# Altium project Servo-Board-v1.0.PrjPcb (part 19 of 19)

## Sheet DIO_4.SchDoc
size 420 x 297 mm; SheetNumber: 32; SheetTotal: 32
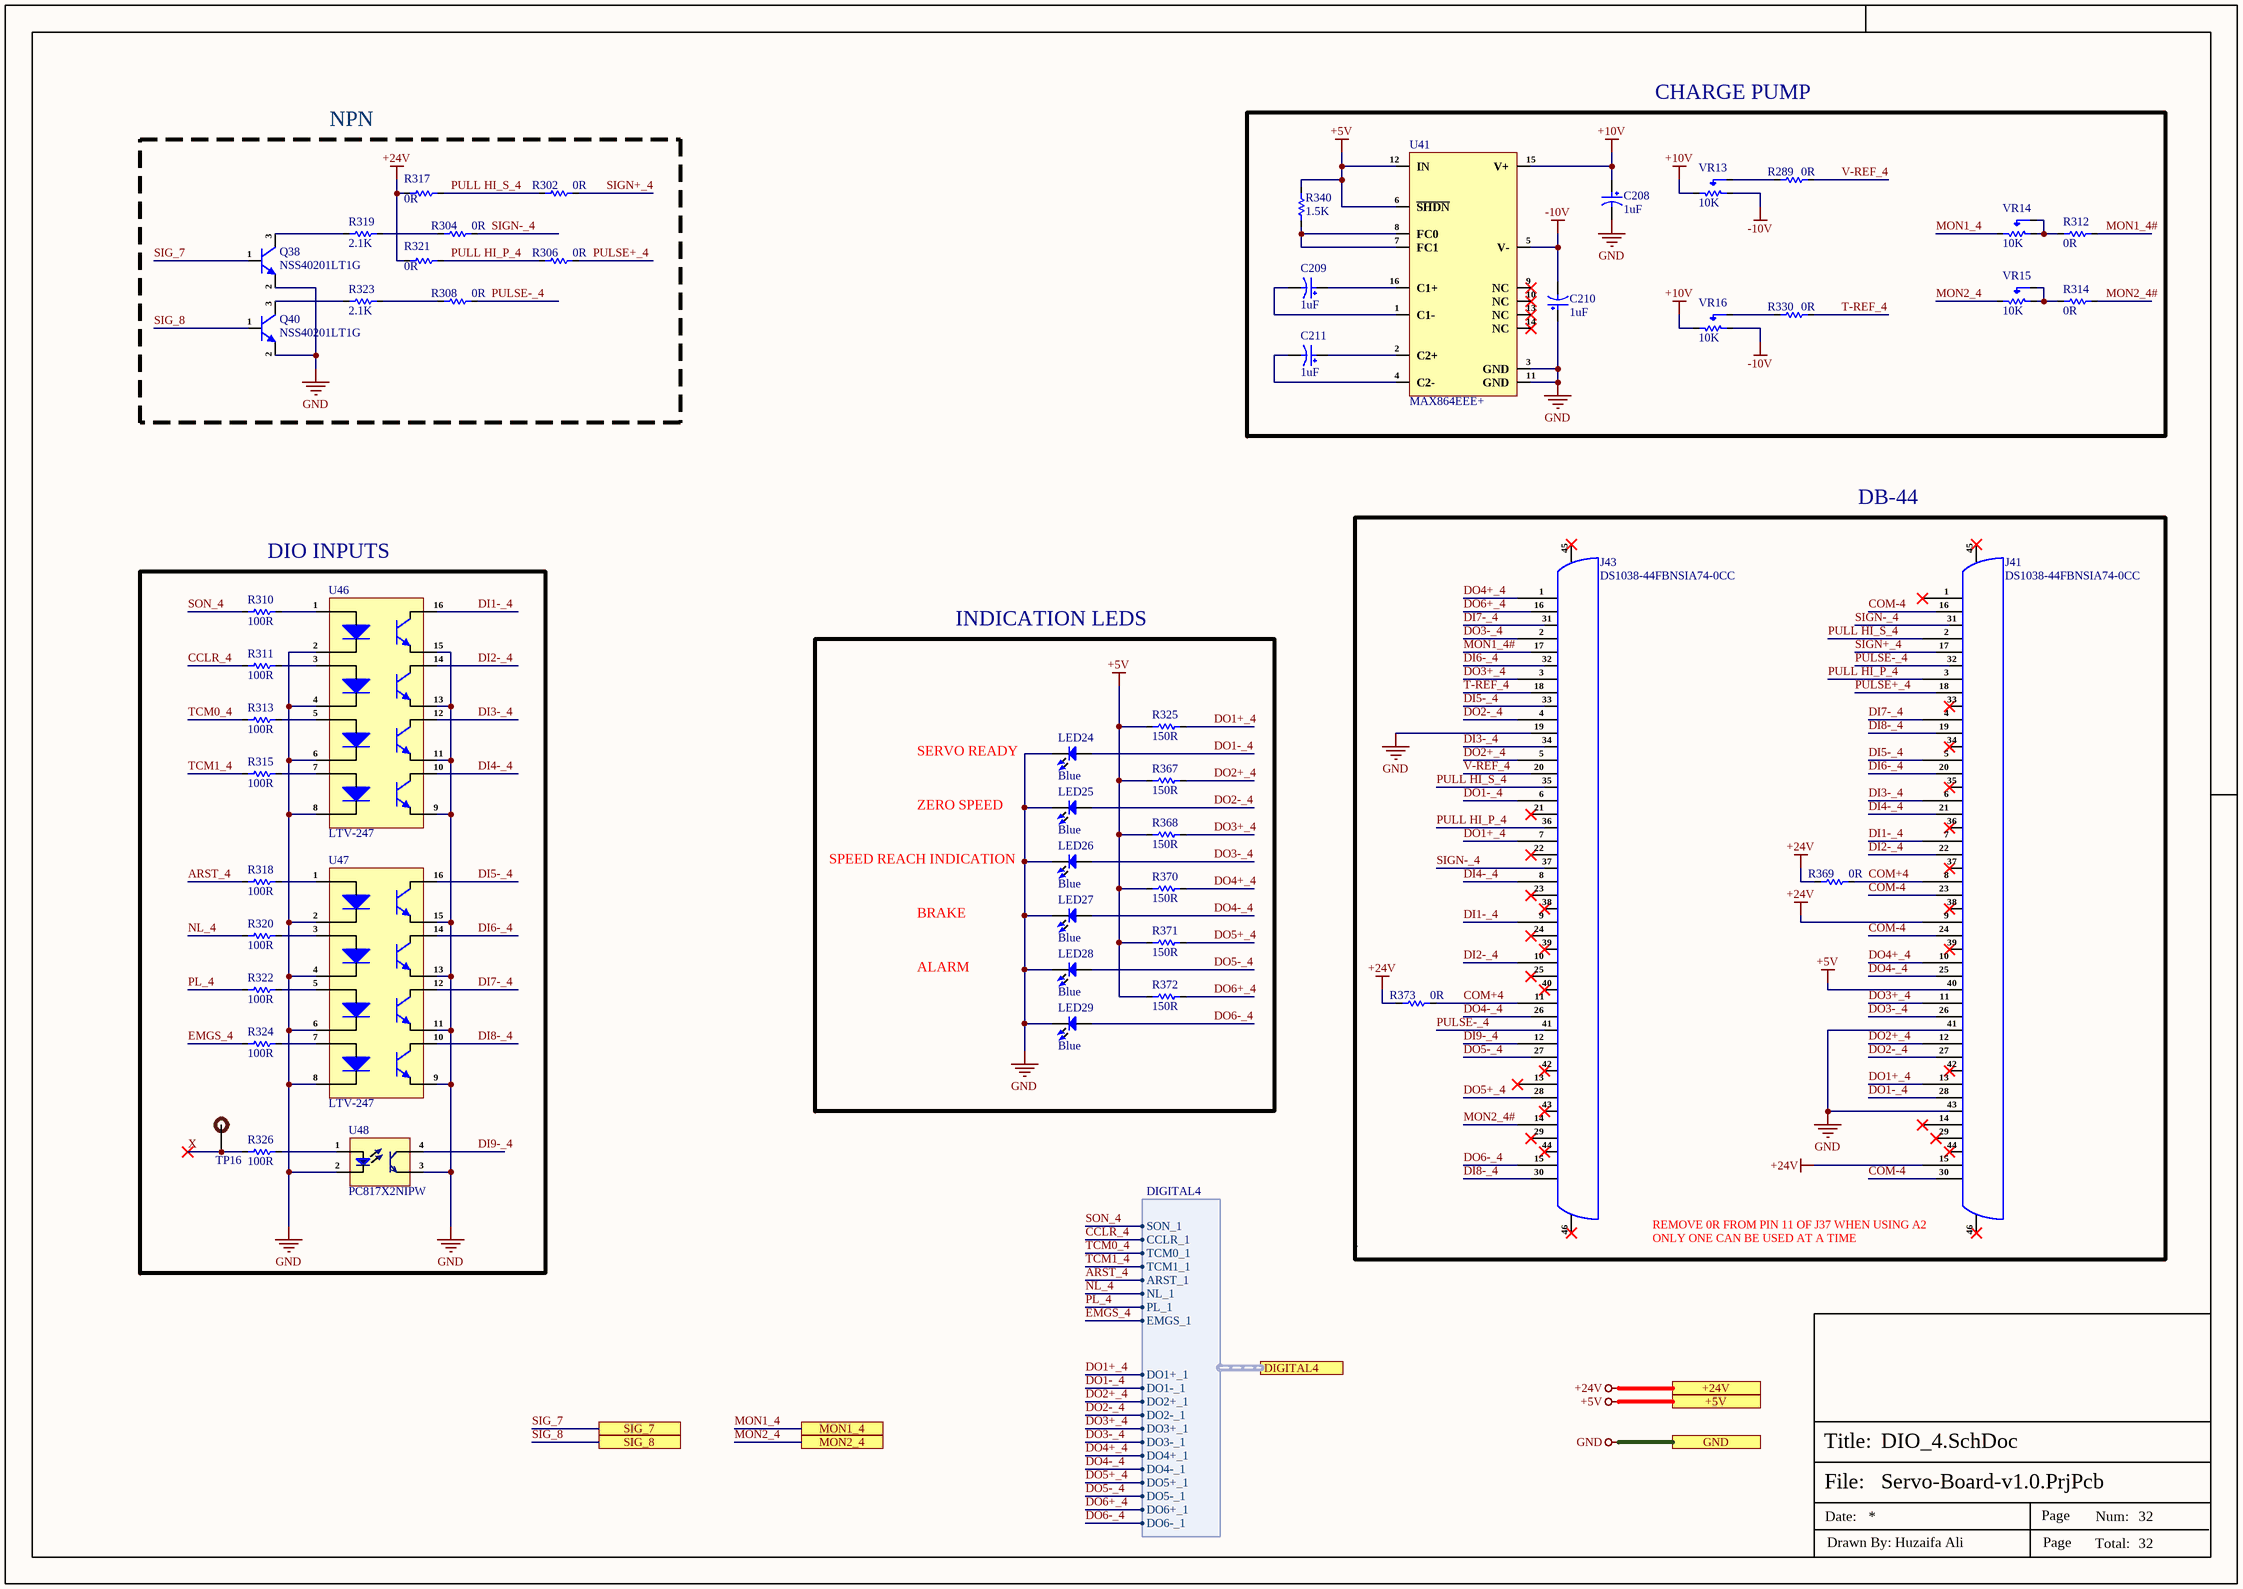
[diagram p31: DIO_4.SchDoc]

### Parts
C208  1uF  [RVT1H1R0M0405]
C209  1uF  [RVT1H1R0M0405]
C210  1uF  [RVT1H1R0M0405]
C211  1uF  [RVT1H1R0M0405]
J41  DS1038-44FBNSIA74-0CC  [DS1038-44FBNSIA74-0CC]
J43  DS1038-44FBNSIA74-0CC  [DS1038-44FBNSIA74-0CC]
LED24  Blue  [LED-0603]
LED25  Blue  [LED-0603]
LED26  Blue  [LED-0603]
LED27  Blue  [LED-0603]
LED28  Blue  [LED-0603]
LED29  Blue  [LED-0603]
Q38  NSS40201LT1G  [SOT-23]
Q40  NSS40201LT1G  [SOT-23]
R289  0R  [Res-0402]
R302  0R  [Res-0603]
R304  0R  [Res-0603]
R306  0R  [Res-0603]
R308  0R  [Res-0603]
R310  100R  [Res-0402]
R311  100R  [Res-0402]
R312  0R  [Res-0402]
R313  100R  [Res-0402]
R314  0R  [Res-0402]
R315  100R  [Res-0402]
R317  0R  [Res-0603]
R318  100R  [Res-0402]
R319  2.1K  [Res-0603]
R320  100R  [Res-0402]
R321  0R  [Res-0603]
R322  100R  [Res-0402]
R323  2.1K  [Res-0603]
R324  100R  [Res-0402]
R325  150R  [Res-0603]
R326  100R  [Res-0402]
R330  0R  [Res-0402]
R340  1.5K  [Res-0402]
R367  150R  [Res-0603]
R368  150R  [Res-0603]
R369  0R  [Res-0402]
R370  150R  [Res-0603]
R371  150R  [Res-0603]
R372  150R  [Res-0603]
R373  0R  [Res-0402]
TP16  TEST POINT  [Test-point]  (value not drawn)  (no BOM)
U41  MAX864EEE+  [16-QSOP]
U46  LTV-247  [16-SO]
U47  LTV-247  [16-SO]
U48  PC817X2NIPW  [PC817X2NIPW]
VR13  10K  [3362P-1-103]
VR14  10K  [3362P-1-103]
VR15  10K  [3362P-1-103]
VR16  10K  [3362P-1-103]

### Blocks framed on the sheet
NPN: Q38 Q40 R302 R304 R306 R308 R317 R319 R321 R323

### Ports
+5V (see Servo4[4C], CAN_Sheet[5D], DIO_1[5D], DIO_2[5D], DIO_3[5D], Encoder_Sheet1[5D], Encoder_Sheet2[5D], Encoder_Sheet3[5D], Encoder_Sheet4[5D], Power_Sheet[5D]), +24V (see Servo4[4C], Connector_Sheet[5D], DIO_1[5D], DIO_2[5D], DIO_3[5D], MOSFET_Driver_Sheet1[5D], MOSFET_Driver_Sheet2[5D], MOSFET_Driver_Sheet3[5D], MOSFET_Driver_Sheet4[5D], Motor_Driver_Sheet1[5D], Motor_Driver_Sheet2[5D], Motor_Driver_Sheet3[5D], Motor_Driver_Sheet4[5D], Power_Sheet[5D]), DIGITAL4 (harness DIGITAL4, see Servo4[4C], Sec_Controller_Sheet4[4D]), GND (see Servo4[4C], CAN_Sheet[5D], Connector_Sheet[5D], Controller_Sheet[5D], DIO_1[5D], DIO_2[5D], DIO_3[5D], Encoder_Sheet1[5D], Encoder_Sheet2[5D], Encoder_Sheet3[5D], Encoder_Sheet4[5D], EtherCAT_Sheet[5D], MOSFET_Driver_Sheet1[5D], MOSFET_Driver_Sheet2[5D], MOSFET_Driver_Sheet3[5D], MOSFET_Driver_Sheet4[5D], Motor_Driver_Sheet1[5D], Motor_Driver_Sheet2[5D], Motor_Driver_Sheet3[5D], Motor_Driver_Sheet4[5D], Power_Sheet[5D], RJ45_Sheet[5D], RS485_RS232_Sheet[3D], Sec_Controller_Sheet1[5D], Sec_Controller_Sheet2[5D], Sec_Controller_Sheet3[5D], Sec_Controller_Sheet4[5D]), MON1_4 (see Servo4[4C], Sec_Controller_Sheet4[3D]), MON2_4 (see Servo4[4C], Sec_Controller_Sheet4[3D]), SIG_7 (see Servo4[4C], Sec_Controller_Sheet4[3D]), SIG_8 (see Servo4[4C], Sec_Controller_Sheet4[3D])

### Harnesses
DIGITAL4: SON_1, TCM0_1, CCLR_1, TCM1_1, ARST_1, NL_1, PL_1, EMGS_1, DO1+_1, DO1-_1, DO2+_1, DO2-_1, DO3+_1, DO3-_1, DO4+_1, DO4-_1, DO5+_1, DO5-_1, DO6+_1, DO6-_1

### Nets
+5V: J41.40 R325.1 R340.2 R367.1 R368.1 R370.1 R371.1 R372.1 U41.6(~{SHDN}) U41.12(IN) ; port +5V
+10V: C208.1 U41.15(V+) VR13.3(CW) VR16.3(CW)
+24V: J41.9 J41.15 R317.1 R321.1 R369.1 R373.1 ; port +24V  [project net VDRAIN]
-10V: C210.2 U41.5(V-) VR13.1(CCW) VR16.1(CCW)
GND: C208.2 C210.1 J41.41 J41.43 J43.19 LED24.2 LED25.2 LED26.2 LED27.2 LED28.2 LED29.2 Q38.2(E) Q40.2(E) U41.3(GND) U41.11(GND) U46.2(K) U46.4(K) U46.6(K) U46.8(K) U46.9(E) U46.11(E) U46.13(E) U46.15(E) U47.2(K) U47.4(K) U47.6(K) U47.8(K) U47.9(E) U47.11(E) U47.13(E) U47.15(E) U48.2(Ca) U48.3(E) ; port GND
ARST_4: R318.1 ; port DIGITAL4.ARST_1
CCLR_4: R311.1 ; port DIGITAL4.CCLR_1
COM+4: J41.8 J43.11 R369.2 R373.2
COM-4: J41.16 J41.23 J41.24 J41.30
DI1-_4: J41.7 J43.9 U46.16(C)
DI2-_4: J41.22 J43.10 U46.14(C)
DI3-_4: J41.6 J43.34 U46.12(C)
DI4-_4: J41.21 J43.8 U46.10(C)
DI5-_4: J41.5 J43.33 U47.16(C)
DI6-_4: J41.20 J43.32 U47.14(C)
DI7-_4: J41.4 J43.31 U47.12(C)
DI8-_4: J41.19 J43.30 U47.10(C)
DI9-_4: J43.12 U48.4(C)
DO1+_4: J41.13 J43.7 R325.2 ; port DIGITAL4.DO1+_1
DO1-_4: J41.28 J43.6 LED24.1 ; port DIGITAL4.DO1-_1
DO2+_4: J41.12 J43.5 R367.2 ; port DIGITAL4.DO2+_1
DO2-_4: J41.27 J43.4 LED25.1 ; port DIGITAL4.DO2-_1
DO3+_4: J41.11 J43.3 R368.2 ; port DIGITAL4.DO3+_1
DO3-_4: J41.26 J43.2 LED26.1 ; port DIGITAL4.DO3-_1
DO4+_4: J41.10 J43.1 R370.2 ; port DIGITAL4.DO4+_1
DO4-_4: J41.25 J43.26 LED27.1 ; port DIGITAL4.DO4-_1
DO5+_4: J43.28 R371.2 ; port DIGITAL4.DO5+_1
DO5-_4: J43.27 LED28.1 ; port DIGITAL4.DO5-_1
DO6+_4: J43.16 R372.2 ; port DIGITAL4.DO6+_1
DO6-_4: J43.15 LED29.1 ; port DIGITAL4.DO6-_1
EMGS_4: R324.1 ; port DIGITAL4.EMGS_1
MON1_4: VR14.3(CW) ; port MON1_4
MON1_4#: J43.17 R312.2
MON2_4: VR15.3(CW) ; port MON2_4
MON2_4#: J43.14 R314.2
NL_4: R320.1 ; port DIGITAL4.NL_1
PL_4: R322.1 ; port DIGITAL4.PL_1
PULL HI_P_4: J41.3 J43.36 R306.1 R321.2
PULL HI_S_4: J41.2 J43.35 R302.1 R317.2
PULSE+_4: J41.18 R306.2
PULSE-_4: J41.32 J43.41 R308.2
SIG_7: Q38.1(B) ; port SIG_7
SIG_8: Q40.1(B) ; port SIG_8
SIGN+_4: J41.17 R302.2
SIGN-_4: J41.31 J43.37 R304.2
SON_4: R310.1 ; port DIGITAL4.SON_1
T-REF_4: J43.18 R330.2
TCM0_4: R313.1 ; port DIGITAL4.TCM0_1
TCM1_4: R315.1 ; port DIGITAL4.TCM1_1
V-REF_4: J43.20 R289.2
X: R326.1 TP16.1
NetC209_1: C209.1 U41.16(C1+)
NetC209_2: C209.2 U41.1(C1-)
NetC211_1: C211.1 U41.2(C2+)
NetC211_2: C211.2 U41.4(C2-)
NetQ38_3: Q38.3(C) R319.1
NetQ40_3: Q40.3(C) R323.1
NetR289_1: R289.1 VR13.2(Wiper)
NetR304_1: R304.1 R319.2
NetR308_1: R308.1 R323.2
NetR310_2: R310.2 U46.1(A)
NetR311_2: R311.2 U46.3(A)
NetR312_1: R312.1 VR14.1(CCW) VR14.2(Wiper)
NetR313_2: R313.2 U46.5(A)
NetR314_1: R314.1 VR15.1(CCW) VR15.2(Wiper)
NetR315_2: R315.2 U46.7(A)
NetR318_2: R318.2 U47.1(A)
NetR320_2: R320.2 U47.3(A)
NetR322_2: R322.2 U47.5(A)
NetR324_2: R324.2 U47.7(A)
NetR326_2: R326.2 U48.1(An)
NetR330_1: R330.1 VR16.2(Wiper)
NetR340_1: R340.1 U41.7(FC1) U41.8(FC0)

Not connected (* = marked no-connect by the designer): J41 1* 14* 29* 33* 34* 35* 36* 37* 38* 39* 42* 44* 45* 46*; J43 13* 21* 22* 23* 24* 25* 29* 38* 39* 40* 42* 43* 44* 45* 46*; U41 9(NC)* 10(NC)* 13(NC)* 14(NC)*

### Notes on the sheet
- CHARGE PUMP
- DB-44
- DIO INPUTS
- INDICATION LEDS
- SERVO READY
- SPEED REACH INDICATION
- ZERO SPEED
- BRAKE
- ALARM
- REMOVE 0R FROM PIN 11 OF J37 WHEN USING A2
- ONLY ONE CAN BE USED AT A TIME
- File:
- Title:
- Date:
- Page
- Num:
- Total:
- Drawn By: Huzaifa Ali

### Library data of the parts
C208-C211 = RVT1H1R0M0405: 1uF 50V 8mA@120Hz ±20% SMD,D4xL5.4mm Aluminum Electrolytic Capacitors - SMD ROHS; Manufacturer: Roqang; Supplier: LCSC; LCSC Part Number: C72491; Manufacturer Part Number: RVT1H1R0M0405; RoHS: No
J41 J43 = DS1038-44FBNSIA74-0CC: 44P Female D-Sub Right-Angle 3 1.5A -40℃~+105℃ Push-Pull D-Sub / VGA connector ROHS; Manufacturer: CONNFLY Elec; Manufacturer Part Number: DS1038-44FBNSIA74-0CC; Package: Push-Pull; LCSC Part Number: C77844; Item Type: D-Sub / VGA connector; ComponentLink1Description: LCSC; ComponentLink1URL: https://www.lcsc.com/product-detail/D-Sub-VGA-connector_CONNFLY-Elec-DS1038-44FBNSIA74-0CC_C77844.html
LED24-LED29 = NCD0603B3: blue 0603 Light Emitting Diodes (LED) ROHS; Manufacturer: Foshan NationStar Optoelectronics; Manufacturer Part Number: NCD0603B3; Package: 0603; LCSC Part Number: C158101; Item Type: LED; ComponentLink1Description: LCSC; ComponentLink1URL: https://www.lcsc.com/product-detail/Light-Emitting-Diodes-LED_Foshan-NationStar-Optoelectronics-NCD0603B3_C158101.html
Q38 Q40 = NSS40201LT1G: TRANS NPN 40V 2A SOT23-3; Manufacturer: ON Semiconductor; Max Power Dissipation: 540mW; Transition Frequency: 150MHz; hFE Min: 200; Number of Elements: 1; Emitter Base Voltage (VEBO): 6V; Collector Emitter Saturation Voltage: 115mV; Element Configuration: Single; Clock Frequency: 100MHz; Item Type: Transistor; Supplier 1: Future Electronics; Manufacturer Part Number: NSS40201LT1G; RoHS: Yes; Category: BJTs; Stock 1: 155; Pricing 1: 1=0.42000, 15=0.34000, 75=0.29500, 300=0.25500, 1500=0.21000 (USD); Case/Package: SOT-23-3; Pins: 3; Min Operating Temperature: -55°C; Max Operating Temperature: 150°C; Collector Emitter Voltage (VCEO): 40V; Packaging: Tape and Reel; Max Collector Current: 2A; Collector Emitter Breakdown Voltage: 40V; Polarity: NPN; Package Quantity: 3000; Frequency: 150MHz; Max Breakdown Voltage: 40V; Collector Base Voltage (VCBO): 40V; Power Dissipation: 540mW; Gain Bandwidth Product: 150MHz; Series: -; Collector-emitter Voltage-Max: 115mV; Length: 3.04mm; Width: 2.64mm; Height: 1.11mm; Radiation Hardening: No; Lead Free: Lead Free; Reach SVHC Compliant: Yes; Halogen Free: Halogen Free; RoHS Compliant: Yes; ComponentLink1URL: https://datasheet.ciiva.com/976/nss40201l-d-976800.pdf?src-supplier=Digi-Key; ComponentLink1Description: https://datasheet.ciiva.com/976/nss40201l-d-976800.pdf?src-supplier=Digi-Key; ComponentLink2URL: https://datasheet.ciiva.com/11204/nss40201l-d-11204882.pdf?src-supplier=Avnet; ComponentLink2Description: https://datasheet.ciiva.com/11204/nss40201l-d-11204882.pdf?src-supplier=Avnet; ComponentLink3URL: https://datasheet.ciiva.com/16291/nss40201l-d-115376-16291797.pdf?src-supplier=Mouser; ComponentLink3Description: https://datasheet.ciiva.com/16291/nss40201l-d-115376-16291797.pdf?src-supplier=Mouser; ComponentLink4URL: https://datasheet.ciiva.com/30480/0900766b8121b5a5-30480502.pdf?src-supplier=Rs; ComponentLink4Description: https://datasheet.ciiva.com/30480/0900766b8121b5a5-30480502.pdf?src-supplier=Rs; ComponentLink5URL: https://datasheet.ciiva.com/976/nss40201l-d-976801.pdf?src-supplier=Digi-Key; ComponentLink5Description: https://datasheet.ciiva.com/976/nss40201l-d-976801.pdf?src-supplier=Digi-Key; ComponentLink6URL: https://datasheet.ciiva.com/976/nss40201l-d-976802.pdf?src-supplier=Digi-Key; ComponentLink6Description: https://datasheet.ciiva.com/976/nss40201l-d-976802.pdf?src-supplier=Digi-Key; ComponentLink7URL: https://datasheet.ciiva.com/22641/nss40201l-d-22641179.pdf?src-supplier=Farnell; ComponentLink7Description: https://datasheet.ciiva.com/22641/nss40201l-d-22641179.pdf?src-supplier=Farnell; ComponentLink8URL: https://datasheet.ciiva.com/16222/nss40201l-d-16222093.pdf?src-supplier=Future+Electronics; ComponentLink8Description: https://datasheet.ciiva.com/16222/nss40201l-d-16222093.pdf?src-supplier=Future+Electronics; Supplier Part Number 1: 6030674; LCSC Part Number: C145175
R289 R312 R314 R330 R369 R373 = RC0402FR-070RL: RES 0 OHM JUMPER 1/16W 0402; Manufacturer: Yageo; Item Type: Resistors; Tolerance: 1%; Power Rating: 62.5mW; Voltage Rating: 50V; Temperature Coefficient: 200ppm/°C; Max Power Dissipation: 63mW; Supplier 1: Mouser; Manufacturer Part Number: RC0402FR-070RL; RoHS: Yes; Stock 1: 8556842; Pricing 1: 1=0.10000, 10=0.01400, 50=0.01400, 100=0.00600, 1000=0.00300, 5000=0.00200, 10000=0.00100 (USD); Mount: Surface Mount; Case/Package: 0402; Contact Plating: Tin,Matte; Case Code (Imperial): 0402; Case Code (Metric): 1005; Size Code: 0402; Min Operating Temperature: -55°C; Max Operating Temperature: 155°C; Resistance: 0R; Resistor Type: Thick Film; Packaging: Tape and Reel; Termination: SMD/SMT; Features: Moisture Resistant; Series: RC; Number of Terminations: 2; Length: 1mm; Width: 0.5mm; Height: 0.35mm; Radiation Hardening: No; Lead Free: Lead Free; RoHS Compliant: Yes; ComponentLink1URL: https://datasheet.ciiva.com/8896/pyu-rc0402-51-rohs-l-6-8896149.pdf?src-supplier=Avnet; ComponentLink1Description: https://datasheet.ciiva.com/8896/pyu-rc0402-51-rohs-l-6-8896149.pdf?src-supplier=Avnet; ComponentLink2URL: https://datasheet.ciiva.com/16790/pyu-rc0402-51-rohs-l-6-r-16790444.pdf?src-supplier=Future+Electronics; ComponentLink2Description: https://datasheet.ciiva.com/16790/pyu-rc0402-51-rohs-l-6-r-16790444.pdf?src-supplier=Future+Electronics; Supplier Part Number 1: 603-RC0402FR-070RL; LCSC Part Number: C106231
R302 R304 R306 R308 R317 R321 = RC0603JR-070RL: RES 0 OHM JUMPER 1/10W 0603; Manufacturer: Yageo; Resistance: 0mR; Tolerance: 1%; Power Rating: 100mW; Voltage Rating (DC): 50V; Temperature Coefficient: 200ppm/°C; Resistance Tolerance: 5%; Item Type: Resistor; Supplier 1: Digi-Key; Manufacturer Part Number: RC0603JR-070RL; RoHS: Yes; Category: Chip SMD Resistors; Stock 1: 18081776; Pricing 1: 1=0.10000, 10=0.01700, 25=0.01240, 50=0.00960, 100=0.00700, 250=0.00536, 500=0.00430, 1000=0.00316 (USD); Case/Package: 0603; Number of Pins: 2; Contact Plating: Tin,Matte; Case Code (Imperial): 0603; Case Code (Metric): 1608; Size Code: 0603; Min Operating Temperature: -55°C; Max Operating Temperature: 155°C; Resistor Type: Thick Film; Packaging: Tape and Reel; Termination: SMD/SMT; Series: RC; Technology: THICK FILM; Package Quantity: 5000; Voltage Rating: 50V; Features: Moisture Resistant; Max Power Dissipation: 100mW; Number of Terminations: 2; Construction: Rectangular; Length: 1.6mm; Width: 0.8mm; Height: 0.45mm; Depth: 0.8mm; Radiation Hardening: No; Reach SVHC Compliant: No SVHC; Lead Free: Lead Free; RoHS Compliant: Yes; Military Standard: Not; Supplier Part Number 1: 311-0.0GRCT-ND; LCSC Part Number: C95177
R310 R311 R313 R315 R318 R320 R322 R324 R326 = RC0402FR-07100RL: RES 100 OHM 1% 1/16W 0402; Manufacturer: Yageo; Power Rating: 62.5mW; Voltage Rating: 50V; Temperature Coefficient: 100ppm/°C; Max Power Dissipation: 63mW; Item Type: Resistor; Supplier 1: Mouser; Manufacturer Part Number: RC0402FR-07100RL; RoHS: Yes; Category: Chip SMD Resistors; Stock 1: 699545; Pricing 1: 1=0.10000, 10=0.01200, 50=0.01200, 100=0.00500, 1000=0.00300, 2500=0.00200, 10000=0.00100 (USD); Case/Package: 0402; Number of Pins: 2; Case Code (Imperial): 0402; Case Code (Metric): 1005; Size Code: 0402; Min Operating Temperature: -55°C; Max Operating Temperature: 155°C; Tolerance: 1%; Voltage Rating (DC): 50V; Resistance: 100R; Packaging: Tape and Reel; Termination: SMD/SMT; Resistor Type: Thick Film; Features: Moisture Resistant; Series: RC; Number of Terminations: 2; Resistance Tolerance: 1%; Construction: Rectangular; Technology: THICK FILM; Length: 1mm; Width: 0.5mm; Height: 0.32mm; Depth: 0.5mm; RoHS Compliant: Yes; REACH SVHC: No SVHC; Military Standard: Not; Lead Free: Lead Free; ComponentLink1URL: https://datasheet.ciiva.com/11808/0900766b80c66297-11808765.pdf?src-supplier=RSComponents; ComponentLink1Description: https://datasheet.ciiva.com/11808/0900766b80c66297-11808765.pdf?src-supplier=RSComponents; ComponentLink2URL: https://datasheet.ciiva.com/7849/1784430-7849810.pdf?src-supplier=Element14; ComponentLink2Description: https://datasheet.ciiva.com/7849/1784430-7849810.pdf?src-supplier=Element14; ComponentLink3URL: https://datasheet.ciiva.com/28367/1018594-28367226.pdf?src-supplier=Element14; ComponentLink3Description: https://datasheet.ciiva.com/28367/1018594-28367226.pdf?src-supplier=Element14; ComponentLink4URL: https://datasheet.ciiva.com/22747/1018594-22747511.pdf?src-supplier=Element14; ComponentLink4Description: https://datasheet.ciiva.com/22747/1018594-22747511.pdf?src-supplier=Element14; ComponentLink5URL: https://datasheet.ciiva.com/12667/pyu-rc0402-51-rohs-l-6-r-12667957.pdf?src-supplier=Mouser; ComponentLink5Description: https://datasheet.ciiva.com/12667/pyu-rc0402-51-rohs-l-6-r-12667957.pdf?src-supplier=Mouser; ComponentLink6URL: https://datasheet.ciiva.com/15189/getdatasheetpartid-329466-15189335.pdf?src-supplier=Verical; ComponentLink6Description: https://datasheet.ciiva.com/15189/getdatasheetpartid-329466-15189335.pdf?src-supplier=Verical; ComponentLink7URL: https://datasheet.ciiva.com/16740/pyu-rc0402-51-rohs-l-6-r-16740566.pdf?src-supplier=Future+Electronics; ComponentLink7Description: https://datasheet.ciiva.com/16740/pyu-rc0402-51-rohs-l-6-r-16740566.pdf?src-supplier=Future+Electronics; Supplier Part Number 1: 603-RC0402FR-07100RL; LCSC Part Number: C106232
R319 R323 = RT0603BRD072K1L: RES SMD 2.1K OHM 0.1% 1/10W 0603; Manufacturer: Yageo; Resistance: 2.1kR; Voltage Rating: 75V; Power Rating: 100mW; Temperature Coefficient: 25ppm/°C; Voltage Rating (DC): 50V; Item Type: Resistor; Supplier 1: Arrow Electronics; Manufacturer Part Number: RT0603BRD072K1L; RoHS: Yes; Category: Chip SMD Resistors; Stock 1: 4891; Pricing 1: 1=0.32000, 10=0.26320, 25=0.26040, 100=0.10310, 250=0.10280, 500=0.10180, 1000=0.06110, 3000=0.03900 (USD); Case/Package: 0603; Case Code (Imperial): 0603; Case Code (Metric): 1608; Min Operating Temperature: -55°C; Max Operating Temperature: 125°C; Tolerance: 0.1%; Packaging: Tape and Reel; Resistor Type: Thin Film; Number of Terminations: 2; Termination: SMD/SMT; Max Power Dissipation: 100mW; Features: Moisture Resistant; Series: RT; Construction: Rectangular; Length: 0.063inch; Width: 0.031inch; Height: 0.022inch; Depth: 0.8mm; Military Standard: Not; Lead Free: Lead Free; RoHS Compliant: Yes; ComponentLink1URL: https://datasheet.ciiva.com/12723/pyu-rt-1-to-0-05-rohs-l-4-12723880.pdf?src-supplier=Mouser; ComponentLink1Description: https://datasheet.ciiva.com/12723/pyu-rt-1-to-0-05-rohs-l-4-12723880.pdf?src-supplier=Mouser; Supplier Part Number 1: RT0603BRD072K1L; LCSC Part Number: C861293
R325 R367 R368 R370-R372 = RC0603DR-07150RL: RES 150 OHM 0.5% 1/10W 0603; Manufacturer: Yageo; Max Power Dissipation: 100mW; Temperature Coefficient: 100ppm/°C; Item Type: Resistor; Supplier 1: Avnet; Manufacturer Part Number: RC0603DR-07150RL; RoHS: Yes; Category: Chip SMD Resistors; Pricing 1: 5000=0.00430, 10000=0.00424, 20000=0.00411 (USD); Case/Package: 0603; Min Operating Temperature: -55°C; Max Operating Temperature: 155°C; Packaging: Tape and Reel; Resistance: 150R; Resistor Type: Thick Film; Number of Terminations: 2; Tolerance: 0.5%; Features: Moisture Resistant; Length: 0.063inch; Width: 0.031inch; Height: 0.022inch; RoHS Compliant: Yes; ComponentLink1URL: http://www.yageo.com.tw/exep/pages/download/literatures/PYu-R_INT-thick_7.pdf?src-supplier=Digi-Key; ComponentLink1Description: http://www.yageo.com.tw/exep/pages/download/literatures/PYu-R_INT-thick_7.pdf?src-supplier=Digi-Key; Supplier Part Number 1: RC0603DR-07150RL; LCSC Part Number: C471801
R340 = RC0402FR-071K5L: RES 1.5K OHM 1% 1/16W 0402; Manufacturer: Yageo; Resistance: 1.5kR; Power Rating: 62.5mW; Voltage Rating: 50V; Temperature Coefficient: 100ppm/°C; Max Power Dissipation: 63mW; Supplier 1: Digi-Key; Manufacturer Part Number: RC0402FR-071K5L; RoHS: Yes; Category: Chip SMD Resistors; Stock 1: 2832947; Pricing 1: 1=0.10000, 10=0.01500, 100=0.00610, 1000=0.00275, 2500=0.00239, 5000=0.00197 (USD); Case/Package: 0402; Case Code (Metric): 1005; Case Code (Imperial): 0402; Size Code: 0402; Min Operating Temperature: -55°C; Max Operating Temperature: 155°C; Resistor Type: Thick Film; Package Quantity: 1; Tolerance: 1%; Packaging: Tape and Reel; Number of Terminations: 2; Termination: SMD/SMT; Features: Moisture Resistant; Series: RC; Resistance Tolerance: 1%; Construction: Rectangular; Technology: THICK FILM; Length: 1mm; Width: 0.02inch; Height: 0.016inch; Depth: 0.5mm; RoHS Compliant: Yes; REACH SVHC: No SVHC; Military Standard: Not; Lead Free: Lead Free; ComponentLink1URL: https://datasheet.ciiva.com/11808/0900766b80c66297-11808238.pdf?src-supplier=RSComponents; ComponentLink1Description: https://datasheet.ciiva.com/11808/0900766b80c66297-11808238.pdf?src-supplier=RSComponents; ComponentLink2URL: https://datasheet.ciiva.com/46394/1018594-46394950.pdf?src-supplier=Element14; ComponentLink2Description: https://datasheet.ciiva.com/46394/1018594-46394950.pdf?src-supplier=Element14; ComponentLink3URL: https://datasheet.ciiva.com/2453/pyu-r-int-thick-7-2453440.pdf?src-supplier=Digi-Key; ComponentLink3Description: https://datasheet.ciiva.com/2453/pyu-r-int-thick-7-2453440.pdf?src-supplier=Digi-Key; ComponentLink4URL: https://datasheet.ciiva.com/2453/pyu-r-int-thick-7-2453441.pdf?src-supplier=Digi-Key; ComponentLink4Description: https://datasheet.ciiva.com/2453/pyu-r-int-thick-7-2453441.pdf?src-supplier=Digi-Key; ComponentLink5URL: https://datasheet.ciiva.com/2453/pyu-r-int-thick-7-2453439.pdf?src-supplier=Digi-Key; ComponentLink5Description: https://datasheet.ciiva.com/2453/pyu-r-int-thick-7-2453439.pdf?src-supplier=Digi-Key; ComponentLink6URL: https://datasheet.ciiva.com/12558/pyu-rc0402-51-rohs-l-6-r-8721-12558542.pdf?src-supplier=Mouser; ComponentLink6Description: https://datasheet.ciiva.com/12558/pyu-rc0402-51-rohs-l-6-r-8721-12558542.pdf?src-supplier=Mouser; ComponentLink7URL: https://datasheet.ciiva.com/7849/1018594-7849863.pdf?src-supplier=Element14; ComponentLink7Description: https://datasheet.ciiva.com/7849/1018594-7849863.pdf?src-supplier=Element14; ComponentLink8URL: https://datasheet.ciiva.com/7849/1018594-7849864.pdf?src-supplier=Element14; ComponentLink8Description: https://datasheet.ciiva.com/7849/1018594-7849864.pdf?src-supplier=Element14; ComponentLink9URL: https://datasheet.ciiva.com/15189/getdatasheetpartid-323992-15189370.pdf?src-supplier=Verical; ComponentLink9Description: https://datasheet.ciiva.com/15189/getdatasheetpartid-323992-15189370.pdf?src-supplier=Verical; Supplier Part Number 1: 311-1.50KLRCT-ND; LCSC Part Number: C114759
TP16 = TEST POINT: Test Point ON; Item Type: TEST POINT
U41 = MAX864EEE+: IC REG CHARGE PUMP INV 16QSOP; Manufacturer: Maxim; Output Current: 20mA; Output Voltage: 12V; Logic Function: Inverting; Number of Outputs: 2; Switching Frequency: 185kHz; Synchronous Rectifier: No; Topology: Boost; Output Type: Adjustable; Max Supply Voltage: 6V; Min Supply Voltage: 1.75V; Operating Supply Current: 7mA; Min Output Voltage: 3.5V; Supplier: Digikey; Supplier Part Number: MAX864EEE+-ND; Manufacturer Part Number: MAX864EEE+; RoHS: Yes; Item Type: IC; Stock: 443; Pricing: 1=4.9, 10=4.399, 25=4.1588, 100=3.6042, 300=3.41937, 500=3.06818, 1000=2.58762, 2500=2.45824 (USD); Mounting Technology: Surface Mount; Case/Package: QSOP; Pins: 16; Weight: 0.010159oz; Min Operating Temperature: -40°C; Max Operating Temperature: 85°C; Packaging: Rail/Tube; Package Quantity: 100; Series: -; Min Input Voltage: 1.75V; Max Output Voltage: 12V; Termination: SMD/SMT; Length: 4.98mm; Width: 3.99mm; Height: 1.55mm; Radiation Hardening: No; Lead Free: Lead Free; RoHS Compliant: Yes; Reach SVHC Compliant: No; ComponentLink1URL: https://datasheet.ciiva.com/3215/max864-3215728.pdf?src-supplier=Avnet; ComponentLink1Description: https://datasheet.ciiva.com/3215/max864-3215728.pdf?src-supplier=Avnet; ComponentLink2URL: https://datasheet.ciiva.com/3216/max864-3216791.pdf?src-supplier=Avnet; ComponentLink2Description: https://datasheet.ciiva.com/3216/max864-3216791.pdf?src-supplier=Avnet; ComponentLink3URL: https://datasheet.ciiva.com/4874/max864-4874972.pdf?src-supplier=Mouser; ComponentLink3Description: https://datasheet.ciiva.com/4874/max864-4874972.pdf?src-supplier=Mouser; ComponentLink4URL: https://datasheet.ciiva.com/7994/9917-7994860.pdf?src-supplier=Element14; ComponentLink4Description: https://datasheet.ciiva.com/7994/9917-7994860.pdf?src-supplier=Element14
U46 U47 = LTV-247: OPTOISO 3.75KV 4CH TRANS 16SO; Manufacturer: Vishay Lite-On; Number of Channels: 4; Collector Emitter Voltage (VCEO): 80V; Reverse Breakdown Voltage: 6V; Forward Voltage: 1.2V; Forward Current: 20mA; Max Power Dissipation: 200mW; Output Current per Channel: 50mA; Collector Emitter Saturation Voltage: 400mV; Power Dissipation: 170mW; Current Transfer Ratio: 600%; Item Type: PhotoTransistor; Supplier 1: Future Electronics; Manufacturer Part Number: LTV-247; RoHS: Yes; Category: Optocouplers; Stock 1: 178000; Pricing 1: 2000=0.77000 (USD); Mount: Surface Mount; Case/Package: SMD/SMT; Number of Pins: 16; Min Operating Temperature: -55°C; Max Operating Temperature: 110°C; Package Quantity: 2000; Packaging: Tape and Reel; Max Output Voltage: 80V; Max Collector Current: 50mA; Number of Elements: 4; Max Input Current: 50mA; Radiation Hardening: No; RoHS Compliant: Yes; ComponentLink1URL: https://datasheet.ciiva.com/24015/ltv-247-256860-24015561.pdf?src-supplier=Mouser; ComponentLink1Description: https://datasheet.ciiva.com/24015/ltv-247-256860-24015561.pdf?src-supplier=Mouser; ComponentLink2URL: https://datasheet.ciiva.com/29730/ltv-214-244-29730320.pdf?src-supplier=Digi-Key; ComponentLink2Description: https://datasheet.ciiva.com/29730/ltv-214-244-29730320.pdf?src-supplier=Digi-Key; Supplier Part Number 1: 3051235; LCSC Part Number: C115451; ComponentLink3Description: LCSC; ComponentLink3URL: https://www.lcsc.com/product-detail/Optocouplers-Phototransistor-Output_Lite-On-LTV-247_C115451.html
U48 = PC817X2NIPW: Optoisolator Output Channel 4-SMD; Manufacturer: Sharp; Item Type: IC; Supplier: Mouser; Supplier Part Number: 852-PC817X2NIPW; Manufacturer Part Number: PC817X2NIPW; RoHS: No; Pricing: 1=0.54, 10=0.352, 50=0.352, 100=0.233, 1000=0.185, 10000=0.146 (USD); LCSC Part Number: C2840443
VR13-VR16 = 3362P-1-103: TRIMMER 10K OHM 0.5W PC PIN TOP; Manufacturer: Bourns; Item Type: Potentiometer; Supplier: Mouser; LCSC Part Number: C118956; Manufacturer Part Number: 3362P-1-103; RoHS: No; Stock: 1436; Pricing: 1=1.97, 10=1.44, 50=1.44, 100=1.13, 1000=0.756, 10000=0.756 (USD); ComponentLink1URL: https://datasheet.ciiva.com/19466/1931499-19466806.pdf?src-supplier=Jameco; ComponentLink1Description: https://datasheet.ciiva.com/19466/1931499-19466806.pdf?src-supplier=Jameco; ComponentLink2URL: https://datasheet.ciiva.com/3266/3362-3266710.pdf?src-supplier=Avnet; ComponentLink2Description: https://datasheet.ciiva.com/3266/3362-3266710.pdf?src-supplier=Avnet; ComponentLink3URL: https://datasheet.ciiva.com/2161/3362-2161230.pdf?src-supplier=Digikey; ComponentLink3Description: https://datasheet.ciiva.com/2161/3362-2161230.pdf?src-supplier=Digikey

## Nets that join several sheets
3.3V_Driver: Motor_Driver_Sheet1 (C82.2 C83.2 L7.2 R72.2), Motor_Driver_Sheet2 (C93.2 C94.2 L8.2 R75.2), Motor_Driver_Sheet3 (C104.2 C105.2 L9.2 R78.2), Motor_Driver_Sheet4 (C115.2 C116.2 L10.2 R81.2)
+3V3: Controller_Sheet (10 pins), Power_Sheet (5 pins), CAN_Sheet (C21.2 U5.5), RS485_RS232_Sheet (9 pins), RJ45_Sheet (12 pins), EtherCAT_Sheet (19 pins), Connector_Sheet (J26.7 J29.7 J31.7 J33.7), Sec_Controller_Sheet1 (13 pins), Motor_Driver_Sheet1 (5 pins), Encoder_Sheet1 (C31.1 R47.1 U9.8), Sec_Controller_Sheet2 (13 pins), Motor_Driver_Sheet2 (5 pins), Encoder_Sheet2 (C33.1 R190.1 U10.8), Motor_Driver_Sheet3 (5 pins), Sec_Controller_Sheet3 (13 pins), Encoder_Sheet3 (C177.1 R215.1 U21.8), Motor_Driver_Sheet4 (5 pins), Sec_Controller_Sheet4 (13 pins), Encoder_Sheet4 (C179.1 R364.1 U22.8)
+5V: Power_Sheet (7 pins), CAN_Sheet (5 pins), Sec_Controller_Sheet1 (9 pins), Encoder_Sheet1 (8 pins), DIO_1 (10 pins), Sec_Controller_Sheet2 (9 pins), Encoder_Sheet2 (8 pins), DIO_2 (10 pins), Sec_Controller_Sheet3 (9 pins), Encoder_Sheet3 (8 pins), DIO_3 (10 pins), Sec_Controller_Sheet4 (9 pins), Encoder_Sheet4 (8 pins), DIO_4 (10 pins)
+10V: DIO_1 (C192.1 U2.15 VR1.3 VR4.3), DIO_2 (C200.1 U31.15 VR5.3 VR8.3), DIO_3 (C204.1 U37.15 VR9.3 VR12.3), DIO_4 (C208.1 U41.15 VR13.3 VR16.3)
-10V: DIO_1 (C194.2 U2.5 VR1.1 VR4.1), DIO_2 (C202.2 U31.5 VR5.1 VR8.1), DIO_3 (C206.2 U37.5 VR9.1 VR12.1), DIO_4 (C210.2 U41.5 VR13.1 VR16.1)
CAN_RX: Controller_Sheet (U1.25), CAN_Sheet (TP6.1 U5.4)
CAN_TX: Controller_Sheet (U1.26), CAN_Sheet (TP7.1 U5.1)
CHASIS GND: RJ45_Sheet (7 pins), Connector_Sheet (16 pins)
GND: Controller_Sheet (27 pins), Power_Sheet (22 pins), CAN_Sheet (7 pins), RS485_RS232_Sheet (12 pins), RJ45_Sheet (10 pins), EtherCAT_Sheet (26 pins), Connector_Sheet (6 pins), Sec_Controller_Sheet1 (35 pins), Motor_Driver_Sheet1 (20 pins), MOSFET_Driver_Sheet1 (11 pins), Encoder_Sheet1 (11 pins), DIO_1 (33 pins), Sec_Controller_Sheet2 (35 pins), MOSFET_Driver_Sheet2 (11 pins), Motor_Driver_Sheet2 (20 pins), Encoder_Sheet2 (11 pins), DIO_2 (33 pins), MOSFET_Driver_Sheet3 (11 pins), Motor_Driver_Sheet3 (20 pins), Sec_Controller_Sheet3 (35 pins), Encoder_Sheet3 (11 pins), DIO_3 (33 pins), MOSFET_Driver_Sheet4 (11 pins), Motor_Driver_Sheet4 (20 pins), Sec_Controller_Sheet4 (35 pins), Encoder_Sheet4 (11 pins), DIO_4 (33 pins)
RE/DE/RS485/T: Controller_Sheet (U1.18), RS485_RS232_Sheet (5 pins)
RS232_RX: RS485_RS232_Sheet (F3.1 TP8.1), Connector_Sheet (J24.1)
RS232_TX: RS485_RS232_Sheet (F4.1 TP9.1), Connector_Sheet (J24.2)
RXD/RS485: Controller_Sheet (U1.19), RS485_RS232_Sheet (R26.1 TP10.1 U7.4)
TXD/RS485: Controller_Sheet (U1.20), RS485_RS232_Sheet (R23.1 TP11.1 U7.1)
VDRAIN: Power_Sheet (10 pins), Connector_Sheet (J28.2), Motor_Driver_Sheet1 (8 pins), MOSFET_Driver_Sheet1 (8 pins), DIO_1 (6 pins), MOSFET_Driver_Sheet2 (8 pins), Motor_Driver_Sheet2 (8 pins), DIO_2 (6 pins), MOSFET_Driver_Sheet3 (8 pins), Motor_Driver_Sheet3 (8 pins), DIO_3 (6 pins), MOSFET_Driver_Sheet4 (8 pins), Motor_Driver_Sheet4 (8 pins), DIO_4 (6 pins)
ARST_1: Sec_Controller_Sheet1 (U29.25), DIO_1 (R238.1)
ARST_2: Sec_Controller_Sheet2 (U35.25), DIO_2 (R268.1)
ARST_3: Sec_Controller_Sheet3 (U49.25), DIO_3 (R293.1)
ARST_4: Sec_Controller_Sheet4 (U51.25), DIO_4 (R318.1)
CAL_A: Sec_Controller_Sheet1 (U11.18), Motor_Driver_Sheet1 (U15.34)
CAL_B: Sec_Controller_Sheet2 (U12.18), Motor_Driver_Sheet2 (U16.34)
CAL_C: Motor_Driver_Sheet3 (U17.34), Sec_Controller_Sheet3 (U13.18)
CAL_D: Motor_Driver_Sheet4 (U18.34), Sec_Controller_Sheet4 (U14.18)
CAN_N: CAN_Sheet (R22.2 U5.12), Connector_Sheet (J22.2)
CAN_P: CAN_Sheet (R20.1 U5.13), Connector_Sheet (J22.1)
CCLR_1: Sec_Controller_Sheet1 (U29.22), DIO_1 (R231.1)
CCLR_2: Sec_Controller_Sheet2 (U35.22), DIO_2 (R261.1)
CCLR_3: Sec_Controller_Sheet3 (U49.22), DIO_3 (R286.1)
CCLR_4: Sec_Controller_Sheet4 (U51.22), DIO_4 (R311.1)
DO1+_1: Sec_Controller_Sheet1 (U30.21), DIO_1 (J25.7 J36.13 R236.2)
DO1+_2: Sec_Controller_Sheet2 (U36.21), DIO_2 (J37.7 J38.13 R269.2)
DO1+_3: Sec_Controller_Sheet3 (U50.21), DIO_3 (J39.13 J40.7 R298.2)
DO1+_4: Sec_Controller_Sheet4 (U52.21), DIO_4 (J41.13 J43.7 R325.2)
DO1-_1: Sec_Controller_Sheet1 (U30.22), DIO_1 (J25.6 J36.28 LED4.1)
DO1-_2: Sec_Controller_Sheet2 (U36.22), DIO_2 (J37.6 J38.28 LED12.1)
DO1-_3: Sec_Controller_Sheet3 (U50.22), DIO_3 (J39.28 J40.6 LED18.1)
DO1-_4: Sec_Controller_Sheet4 (U52.22), DIO_4 (J41.28 J43.6 LED24.1)
DO2+_1: Sec_Controller_Sheet1 (U30.23), DIO_1 (J25.5 J36.12 R237.2)
DO2+_2: Sec_Controller_Sheet2 (U36.23), DIO_2 (J37.5 J38.12 R271.2)
DO2+_3: Sec_Controller_Sheet3 (U50.23), DIO_3 (J39.12 J40.5 R300.2)
DO2+_4: Sec_Controller_Sheet4 (U52.23), DIO_4 (J41.12 J43.5 R367.2)
DO2-_1: Sec_Controller_Sheet1 (U30.24), DIO_1 (J25.4 J36.27 LED7.1)
DO2-_2: Sec_Controller_Sheet2 (U36.24), DIO_2 (J37.4 J38.27 LED13.1)
DO2-_3: Sec_Controller_Sheet3 (U50.24), DIO_3 (J39.27 J40.4 LED19.1)
DO2-_4: Sec_Controller_Sheet4 (U52.24), DIO_4 (J41.27 J43.4 LED25.1)
DO3+_1: Sec_Controller_Sheet1 (U30.25), DIO_1 (J25.3 J36.11 R239.2)
DO3+_2: Sec_Controller_Sheet2 (U36.25), DIO_2 (J37.3 J38.11 R273.2)
DO3+_3: Sec_Controller_Sheet3 (U50.25), DIO_3 (J39.11 J40.3 R303.2)
DO3+_4: Sec_Controller_Sheet4 (U52.25), DIO_4 (J41.11 J43.3 R368.2)
DO3-_1: Sec_Controller_Sheet1 (U30.26), DIO_1 (J25.2 J36.26 LED8.1)
DO3-_2: Sec_Controller_Sheet2 (U36.26), DIO_2 (J37.2 J38.26 LED14.1)
DO3-_3: Sec_Controller_Sheet3 (U50.26), DIO_3 (J39.26 J40.2 LED20.1)
DO3-_4: Sec_Controller_Sheet4 (U52.26), DIO_4 (J41.26 J43.2 LED26.1)
DO4+_1: Sec_Controller_Sheet1 (U30.27), DIO_1 (J25.1 J36.10 R241.2)
DO4+_2: Sec_Controller_Sheet2 (U36.27), DIO_2 (J37.1 J38.10 R277.2)
DO4+_3: Sec_Controller_Sheet3 (U50.27), DIO_3 (J39.10 J40.1 R307.2)
DO4+_4: Sec_Controller_Sheet4 (U52.27), DIO_4 (J41.10 J43.1 R370.2)
DO4-_1: Sec_Controller_Sheet1 (U30.1), DIO_1 (J25.26 J36.25 LED9.1)
DO4-_2: Sec_Controller_Sheet2 (U36.1), DIO_2 (J37.26 J38.25 LED15.1)
DO4-_3: Sec_Controller_Sheet3 (U50.1), DIO_3 (J39.25 J40.26 LED21.1)
DO4-_4: Sec_Controller_Sheet4 (U52.1), DIO_4 (J41.25 J43.26 LED27.1)
DO5+_1: Sec_Controller_Sheet1 (U30.2), DIO_1 (J25.28 R245.2)
DO5+_2: Sec_Controller_Sheet2 (U36.2), DIO_2 (J37.28 R278.2)
DO5+_3: Sec_Controller_Sheet3 (U50.2), DIO_3 (J40.28 R309.2)
DO5+_4: Sec_Controller_Sheet4 (U52.2), DIO_4 (J43.28 R371.2)
DO5-_1: Sec_Controller_Sheet1 (U30.3), DIO_1 (J25.27 LED10.1)
DO5-_2: Sec_Controller_Sheet2 (U36.3), DIO_2 (J37.27 LED16.1)
DO5-_3: Sec_Controller_Sheet3 (U50.3), DIO_3 (J40.27 LED22.1)
DO5-_4: Sec_Controller_Sheet4 (U52.3), DIO_4 (J43.27 LED28.1)
DO6+_1: Sec_Controller_Sheet1 (U30.4), DIO_1 (J25.16 R253.2)
DO6+_2: Sec_Controller_Sheet2 (U36.4), DIO_2 (J37.16 R279.2)
DO6+_3: Sec_Controller_Sheet3 (U50.4), DIO_3 (J40.16 R316.2)
DO6+_4: Sec_Controller_Sheet4 (U52.4), DIO_4 (J43.16 R372.2)
DO6-_1: Sec_Controller_Sheet1 (U30.5), DIO_1 (J25.15 LED11.1)
DO6-_2: Sec_Controller_Sheet2 (U36.5), DIO_2 (J37.15 LED17.1)
DO6-_3: Sec_Controller_Sheet3 (U50.5), DIO_3 (J40.15 LED23.1)
DO6-_4: Sec_Controller_Sheet4 (U52.5), DIO_4 (J43.15 LED29.1)
EMGS_1: Sec_Controller_Sheet1 (U29.1), DIO_1 (R244.1)
EMGS_2: Sec_Controller_Sheet2 (U35.1), DIO_2 (R274.1)
EMGS_3: Sec_Controller_Sheet3 (U49.1), DIO_3 (R299.1)
EMGS_4: Sec_Controller_Sheet4 (U51.1), DIO_4 (R324.1)
EN1_N: Connector_Sheet (J26.4), Encoder_Sheet1 (F5.2)
EN1_P: Connector_Sheet (J26.6), Encoder_Sheet1 (F6.2)
EN2_N: Connector_Sheet (J29.4), Encoder_Sheet2 (F7.2)
EN2_P: Connector_Sheet (J29.6), Encoder_Sheet2 (F8.2)
EN3_N: Connector_Sheet (J31.4), Encoder_Sheet3 (F9.2)
EN3_P: Connector_Sheet (J31.6), Encoder_Sheet3 (F10.2)
EN4_N: Connector_Sheet (J33.4), Encoder_Sheet4 (F11.2)
EN4_P: Connector_Sheet (J33.6), Encoder_Sheet4 (F12.2)
EN_CAN: Controller_Sheet (U1.23), CAN_Sheet (U5.6)
ENABLE_A: Sec_Controller_Sheet1 (U11.33), Motor_Driver_Sheet1 (U15.33)
ENABLE_B: Sec_Controller_Sheet2 (U12.33), Motor_Driver_Sheet2 (U16.33)
ENABLE_C: Motor_Driver_Sheet3 (U17.33), Sec_Controller_Sheet3 (U13.33)
ENABLE_D: Motor_Driver_Sheet4 (U18.33), Sec_Controller_Sheet4 (U14.33)
GHA_A: Motor_Driver_Sheet1 (U15.8), MOSFET_Driver_Sheet1 (R84.1)
GHA_B: MOSFET_Driver_Sheet2 (R99.1), Motor_Driver_Sheet2 (U16.8)
GHA_C: MOSFET_Driver_Sheet3 (R114.1), Motor_Driver_Sheet3 (U17.8)
GHA_D: MOSFET_Driver_Sheet4 (R129.1), Motor_Driver_Sheet4 (U18.8)
GHB_A: Motor_Driver_Sheet1 (U15.17), MOSFET_Driver_Sheet1 (R85.1)
GHB_B: MOSFET_Driver_Sheet2 (R100.1), Motor_Driver_Sheet2 (U16.17)
GHB_C: MOSFET_Driver_Sheet3 (R115.1), Motor_Driver_Sheet3 (U17.17)
GHB_D: MOSFET_Driver_Sheet4 (R130.1), Motor_Driver_Sheet4 (U18.17)
GHC_A: Motor_Driver_Sheet1 (U15.18), MOSFET_Driver_Sheet1 (R86.1)
GHC_B: MOSFET_Driver_Sheet2 (R101.1), Motor_Driver_Sheet2 (U16.18)
GHC_C: MOSFET_Driver_Sheet3 (R116.1), Motor_Driver_Sheet3 (U17.18)
GHC_D: MOSFET_Driver_Sheet4 (R131.1), Motor_Driver_Sheet4 (U18.18)
GLA_A: Motor_Driver_Sheet1 (U15.10), MOSFET_Driver_Sheet1 (R90.1)
GLA_B: MOSFET_Driver_Sheet2 (R105.1), Motor_Driver_Sheet2 (U16.10)
GLA_C: MOSFET_Driver_Sheet3 (R120.1), Motor_Driver_Sheet3 (U17.10)
GLA_D: MOSFET_Driver_Sheet4 (R135.1), Motor_Driver_Sheet4 (U18.10)
GLB_A: Motor_Driver_Sheet1 (U15.15), MOSFET_Driver_Sheet1 (R91.1)
GLB_B: MOSFET_Driver_Sheet2 (R106.1), Motor_Driver_Sheet2 (U16.15)
GLB_C: MOSFET_Driver_Sheet3 (R121.1), Motor_Driver_Sheet3 (U17.15)
GLB_D: MOSFET_Driver_Sheet4 (R136.1), Motor_Driver_Sheet4 (U18.15)
GLC_A: Motor_Driver_Sheet1 (U15.20), MOSFET_Driver_Sheet1 (R92.1)
GLC_B: MOSFET_Driver_Sheet2 (R107.1), Motor_Driver_Sheet2 (U16.20)
GLC_C: MOSFET_Driver_Sheet3 (R122.1), Motor_Driver_Sheet3 (U17.20)
GLC_D: MOSFET_Driver_Sheet4 (R137.1), Motor_Driver_Sheet4 (U18.20)
INH_MASK: Controller_Sheet (U1.24), CAN_Sheet (U5.11)
INHA_A: Sec_Controller_Sheet1 (U11.29), Motor_Driver_Sheet1 (U15.37)
INHA_B: Sec_Controller_Sheet2 (U12.29), Motor_Driver_Sheet2 (U16.37)
INHA_C: Motor_Driver_Sheet3 (U17.37), Sec_Controller_Sheet3 (U13.29)
INHA_D: Motor_Driver_Sheet4 (U18.37), Sec_Controller_Sheet4 (U14.29)
INHB_A: Sec_Controller_Sheet1 (U11.30), Motor_Driver_Sheet1 (U15.39)
INHB_B: Sec_Controller_Sheet2 (U12.30), Motor_Driver_Sheet2 (U16.39)
INHB_C: Motor_Driver_Sheet3 (U17.39), Sec_Controller_Sheet3 (U13.30)
INHB_D: Motor_Driver_Sheet4 (U18.39), Sec_Controller_Sheet4 (U14.30)
INHC_A: Sec_Controller_Sheet1 (U11.31), Motor_Driver_Sheet1 (U15.41)
INHC_B: Sec_Controller_Sheet2 (U12.31), Motor_Driver_Sheet2 (U16.41)
INHC_C: Motor_Driver_Sheet3 (U17.41), Sec_Controller_Sheet3 (U13.31)
INHC_D: Motor_Driver_Sheet4 (U18.41), Sec_Controller_Sheet4 (U14.31)
INLA_A: Sec_Controller_Sheet1 (U11.26), Motor_Driver_Sheet1 (U15.38)
INLA_B: Sec_Controller_Sheet2 (U12.26), Motor_Driver_Sheet2 (U16.38)
INLA_C: Motor_Driver_Sheet3 (U17.38), Sec_Controller_Sheet3 (U13.26)
INLA_D: Motor_Driver_Sheet4 (U18.38), Sec_Controller_Sheet4 (U14.26)
INLB_A: Sec_Controller_Sheet1 (U11.27), Motor_Driver_Sheet1 (U15.40)
INLB_B: Sec_Controller_Sheet2 (U12.27), Motor_Driver_Sheet2 (U16.40)
INLB_C: Motor_Driver_Sheet3 (U17.40), Sec_Controller_Sheet3 (U13.27)
INLB_D: Motor_Driver_Sheet4 (U18.40), Sec_Controller_Sheet4 (U14.27)
INLC_A: Sec_Controller_Sheet1 (U11.28), Motor_Driver_Sheet1 (U15.42)
INLC_B: Sec_Controller_Sheet2 (U12.28), Motor_Driver_Sheet2 (U16.42)
INLC_C: Motor_Driver_Sheet3 (U17.42), Sec_Controller_Sheet3 (U13.28)
INLC_D: Motor_Driver_Sheet4 (U18.42), Sec_Controller_Sheet4 (U14.28)
LEDPOL0: RJ45_Sheet (R149.1), EtherCAT_Sheet (R168.2 U19.48)
LEDPOL1: RJ45_Sheet (R150.1), EtherCAT_Sheet (R169.2 U19.46)
M1_A: Connector_Sheet (J27.1), MOSFET_Driver_Sheet1 (Q1.3 Q7.2 R87.1)
M1_B: Connector_Sheet (J27.2), MOSFET_Driver_Sheet1 (Q4.3 Q8.2 R88.1)
M1_C: Connector_Sheet (J27.3), MOSFET_Driver_Sheet1 (Q5.3 Q9.2 R89.1)
M2_A: Connector_Sheet (J30.1), MOSFET_Driver_Sheet2 (Q10.3 Q13.2 R102.1)
M2_B: Connector_Sheet (J30.2), MOSFET_Driver_Sheet2 (Q11.3 Q14.2 R103.1)
M2_C: Connector_Sheet (J30.3), MOSFET_Driver_Sheet2 (Q12.3 Q15.2 R104.1)
M3_A: Connector_Sheet (J32.1), MOSFET_Driver_Sheet3 (Q16.3 Q19.2 R117.1)
M3_B: Connector_Sheet (J32.2), MOSFET_Driver_Sheet3 (Q17.3 Q20.2 R118.1)
M3_C: Connector_Sheet (J32.3), MOSFET_Driver_Sheet3 (Q18.3 Q21.2 R119.1)
M4_A: Connector_Sheet (J34.1), MOSFET_Driver_Sheet4 (Q22.3 Q41.2 R132.1)
M4_B: Connector_Sheet (J34.2), MOSFET_Driver_Sheet4 (Q23.3 Q42.2 R133.1)
M4_C: Connector_Sheet (J34.3), MOSFET_Driver_Sheet4 (Q24.3 Q43.2 R134.1)
MON1_1: Sec_Controller_Sheet1 (U11.10), DIO_1 (VR2.3)
MON1_2: Sec_Controller_Sheet2 (U12.10), DIO_2 (VR6.3)
MON1_3: Sec_Controller_Sheet3 (U13.10), DIO_3 (VR10.3)
MON1_4: Sec_Controller_Sheet4 (U14.10), DIO_4 (VR14.3)
MON2_1: Sec_Controller_Sheet1 (U11.11), DIO_1 (VR3.3)
MON2_2: Sec_Controller_Sheet2 (U12.11), DIO_2 (VR7.3)
MON2_3: Sec_Controller_Sheet3 (U13.11), DIO_3 (VR11.3)
MON2_4: Sec_Controller_Sheet4 (U14.11), DIO_4 (VR15.3)
nFAULT_A: Sec_Controller_Sheet1 (U11.25), Motor_Driver_Sheet1 (U15.28)
nFAULT_B: Sec_Controller_Sheet2 (U12.25), Motor_Driver_Sheet2 (U16.28)
nFAULT_C: Motor_Driver_Sheet3 (U17.28), Sec_Controller_Sheet3 (U13.25)
nFAULT_CAN: Controller_Sheet (U1.21), CAN_Sheet (U5.8)
nFAULT_D: Motor_Driver_Sheet4 (U18.28), Sec_Controller_Sheet4 (U14.25)
NL_1: Sec_Controller_Sheet1 (U29.26), DIO_1 (R240.1)
NL_2: Sec_Controller_Sheet2 (U35.26), DIO_2 (R270.1)
NL_3: Sec_Controller_Sheet3 (U49.26), DIO_3 (R295.1)
NL_4: Sec_Controller_Sheet4 (U51.26), DIO_4 (R320.1)
nSCS_A: Sec_Controller_Sheet1 (U11.32), Motor_Driver_Sheet1 (R356.2 U15.32)
nSCS_B: Sec_Controller_Sheet2 (U12.32), Motor_Driver_Sheet2 (R358.2 U16.32)
nSCS_C: Motor_Driver_Sheet3 (R360.2 U17.32), Sec_Controller_Sheet3 (U13.32)
nSCS_D: Motor_Driver_Sheet4 (R362.2 U18.32), Sec_Controller_Sheet4 (U14.32)
nSTB_CAN: Controller_Sheet (U1.22), CAN_Sheet (U5.14)
PL_1: Sec_Controller_Sheet1 (U29.27), DIO_1 (R242.1)
PL_2: Sec_Controller_Sheet2 (U35.27), DIO_2 (R272.1)
PL_3: Sec_Controller_Sheet3 (U49.27), DIO_3 (R297.1)
PL_4: Sec_Controller_Sheet4 (U51.27), DIO_4 (R322.1)
RE/DE/ENCD_1: Sec_Controller_Sheet1 (U11.19), Encoder_Sheet1 (R187.2)
RE/DE/ENCD_2: Sec_Controller_Sheet2 (U12.19), Encoder_Sheet2 (R202.2)
RE/DE/ENCD_3: Sec_Controller_Sheet3 (U13.19), Encoder_Sheet3 (R217.2)
RE/DE/ENCD_4: Sec_Controller_Sheet4 (U14.19), Encoder_Sheet4 (R366.2)
RS485_N: RS485_RS232_Sheet (F1.2), Connector_Sheet (J23.1)
RS485_P: RS485_RS232_Sheet (F2.2), Connector_Sheet (J23.2)
RXA_N: RJ45_Sheet (C138.2 J20.6 R144.1), EtherCAT_Sheet (U19.54)
RXA_P: RJ45_Sheet (C139.2 J20.3 R145.1), EtherCAT_Sheet (U19.55)
RXB_N: RJ45_Sheet (C144.2 J21.6 R152.1), EtherCAT_Sheet (U19.61)
RXB_P: RJ45_Sheet (C145.2 J21.3 R153.1), EtherCAT_Sheet (U19.60)
RXD-ENCD_1: Sec_Controller_Sheet1 (U11.21), Encoder_Sheet1 (U9.6)
RXD-ENCD_2: Sec_Controller_Sheet2 (U12.21), Encoder_Sheet2 (U10.6)
RXD-ENCD_3: Sec_Controller_Sheet3 (U13.21), Encoder_Sheet3 (U21.6)
RXD-ENCD_4: Sec_Controller_Sheet4 (U14.21), Encoder_Sheet4 (U22.6)
RXD/RS232: Controller_Sheet (U1.28), RS485_RS232_Sheet (U6.9)
SDI_A: Sec_Controller_Sheet1 (U11.41), Motor_Driver_Sheet1 (U15.30)
SDI_B: Sec_Controller_Sheet2 (U12.41), Motor_Driver_Sheet2 (U16.30)
SDI_C: Motor_Driver_Sheet3 (U17.30), Sec_Controller_Sheet3 (U13.41)
SDI_D: Motor_Driver_Sheet4 (U18.30), Sec_Controller_Sheet4 (U14.41)
SDO_A: Sec_Controller_Sheet1 (U11.40), Motor_Driver_Sheet1 (R355.1 U15.29)
SDO_B: Sec_Controller_Sheet2 (U12.40), Motor_Driver_Sheet2 (R357.1 U16.29)
SDO_C: Motor_Driver_Sheet3 (R359.1 U17.29), Sec_Controller_Sheet3 (U13.40)
SDO_D: Motor_Driver_Sheet4 (R361.1 U18.29), Sec_Controller_Sheet4 (U14.40)
SHA_A: Motor_Driver_Sheet1 (U15.9), MOSFET_Driver_Sheet1 (R87.2)
SHA_B: MOSFET_Driver_Sheet2 (R102.2), Motor_Driver_Sheet2 (U16.9)
SHA_C: MOSFET_Driver_Sheet3 (R117.2), Motor_Driver_Sheet3 (U17.9)
SHA_D: MOSFET_Driver_Sheet4 (R132.2), Motor_Driver_Sheet4 (U18.9)
SHB_A: Motor_Driver_Sheet1 (U15.16), MOSFET_Driver_Sheet1 (R88.2)
SHB_B: MOSFET_Driver_Sheet2 (R103.2), Motor_Driver_Sheet2 (U16.16)
SHB_C: MOSFET_Driver_Sheet3 (R118.2), Motor_Driver_Sheet3 (U17.16)
SHB_D: MOSFET_Driver_Sheet4 (R133.2), Motor_Driver_Sheet4 (U18.16)
SHC_A: Motor_Driver_Sheet1 (U15.19), MOSFET_Driver_Sheet1 (R89.2)
SHC_B: MOSFET_Driver_Sheet2 (R104.2), Motor_Driver_Sheet2 (U16.19)
SHC_C: MOSFET_Driver_Sheet3 (R119.2), Motor_Driver_Sheet3 (U17.19)
SHC_D: MOSFET_Driver_Sheet4 (R134.2), Motor_Driver_Sheet4 (U18.19)
SIG_1: Sec_Controller_Sheet1 (U29.2), DIO_1 (Q26.1)
SIG_2: Sec_Controller_Sheet1 (U29.3), DIO_1 (Q28.1)
SIG_3: Sec_Controller_Sheet2 (U35.2), DIO_2 (Q30.1)
SIG_4: Sec_Controller_Sheet2 (U35.3), DIO_2 (Q32.1)
SIG_5: Sec_Controller_Sheet3 (U49.2), DIO_3 (Q34.1)
SIG_6: Sec_Controller_Sheet3 (U49.3), DIO_3 (Q36.1)
SIG_7: Sec_Controller_Sheet4 (U51.2), DIO_4 (Q38.1)
SIG_8: Sec_Controller_Sheet4 (U51.3), DIO_4 (Q40.1)
SNA_A: Motor_Driver_Sheet1 (C235.1 U15.12), MOSFET_Driver_Sheet1 (R96.2)
SNA_B: MOSFET_Driver_Sheet2 (R111.2), Motor_Driver_Sheet2 (C238.1 U16.12)
SNA_C: MOSFET_Driver_Sheet3 (R126.2), Motor_Driver_Sheet3 (C241.1 U17.12)
SNA_D: MOSFET_Driver_Sheet4 (R141.2), Motor_Driver_Sheet4 (C244.1 U18.12)
SNB_A: Motor_Driver_Sheet1 (C234.1 U15.13), MOSFET_Driver_Sheet1 (R97.2)
SNB_B: MOSFET_Driver_Sheet2 (R112.2), Motor_Driver_Sheet2 (C237.1 U16.13)
SNB_C: MOSFET_Driver_Sheet3 (R127.2), Motor_Driver_Sheet3 (C240.1 U17.13)
SNB_D: MOSFET_Driver_Sheet4 (R142.2), Motor_Driver_Sheet4 (C243.1 U18.13)
SNC_A: Motor_Driver_Sheet1 (C233.1 U15.22), MOSFET_Driver_Sheet1 (R98.2)
SNC_B: MOSFET_Driver_Sheet2 (R113.2), Motor_Driver_Sheet2 (C236.1 U16.22)
SNC_C: MOSFET_Driver_Sheet3 (R128.2), Motor_Driver_Sheet3 (C239.1 U17.22)
SNC_D: MOSFET_Driver_Sheet4 (R143.2), Motor_Driver_Sheet4 (C242.1 U18.22)
SOA_A: Sec_Controller_Sheet1 (U11.15), Motor_Driver_Sheet1 (C223.2 R336.1)
SOA_B: Sec_Controller_Sheet2 (U12.15), Motor_Driver_Sheet2 (C224.2 R348.1)
SOA_C: Motor_Driver_Sheet3 (C228.2 R351.1), Sec_Controller_Sheet3 (U13.15)
SOA_D: Motor_Driver_Sheet4 (C232.2 R354.1), Sec_Controller_Sheet4 (U14.15)
SOB_A: Sec_Controller_Sheet1 (U11.16), Motor_Driver_Sheet1 (C222.2 R335.1)
SOB_B: Sec_Controller_Sheet2 (U12.16), Motor_Driver_Sheet2 (C117.2 R347.1)
SOB_C: Motor_Driver_Sheet3 (C227.2 R350.1), Sec_Controller_Sheet3 (U13.16)
SOB_D: Motor_Driver_Sheet4 (C231.2 R353.1), Sec_Controller_Sheet4 (U14.16)
SOC_A: Sec_Controller_Sheet1 (U11.17), Motor_Driver_Sheet1 (C221.2 R331.1)
SOC_B: Sec_Controller_Sheet2 (U12.17), Motor_Driver_Sheet2 (C106.2 R346.1)
SOC_C: Motor_Driver_Sheet3 (C226.2 R349.1), Sec_Controller_Sheet3 (U13.17)
SOC_D: Motor_Driver_Sheet4 (C230.2 R352.1), Sec_Controller_Sheet4 (U14.17)
SON_1: Sec_Controller_Sheet1 (U29.21), DIO_1 (R230.1)
SON_2: Sec_Controller_Sheet2 (U35.21), DIO_2 (R260.1)
SON_3: Sec_Controller_Sheet3 (U49.21), DIO_3 (R285.1)
SON_4: Sec_Controller_Sheet4 (U51.21), DIO_4 (R310.1)
SPA_A: Motor_Driver_Sheet1 (C235.2 U15.11), MOSFET_Driver_Sheet1 (Q7.3 R93.2)
SPA_B: MOSFET_Driver_Sheet2 (Q13.3 R108.2), Motor_Driver_Sheet2 (C238.2 U16.11)
SPA_C: MOSFET_Driver_Sheet3 (Q19.3 R123.2), Motor_Driver_Sheet3 (C241.2 U17.11)
SPA_D: MOSFET_Driver_Sheet4 (Q41.3 R138.2), Motor_Driver_Sheet4 (C244.2 U18.11)
SPB_A: Motor_Driver_Sheet1 (C234.2 U15.14), MOSFET_Driver_Sheet1 (Q8.3 R94.2)
SPB_B: MOSFET_Driver_Sheet2 (Q14.3 R109.2), Motor_Driver_Sheet2 (C237.2 U16.14)
SPB_C: MOSFET_Driver_Sheet3 (Q20.3 R124.2), Motor_Driver_Sheet3 (C240.2 U17.14)
SPB_D: MOSFET_Driver_Sheet4 (Q42.3 R139.2), Motor_Driver_Sheet4 (C243.2 U18.14)
SPC_A: Motor_Driver_Sheet1 (C233.2 U15.21), MOSFET_Driver_Sheet1 (Q9.3 R95.2)
SPC_B: MOSFET_Driver_Sheet2 (Q15.3 R110.2), Motor_Driver_Sheet2 (C236.2 U16.21)
SPC_C: MOSFET_Driver_Sheet3 (Q21.3 R125.2), Motor_Driver_Sheet3 (C239.2 U17.21)
SPC_D: MOSFET_Driver_Sheet4 (Q43.3 R140.2), Motor_Driver_Sheet4 (C242.2 U18.21)
SPI2_MISO: Controller_Sheet (U1.58), EtherCAT_Sheet (U19.13)
SPI2_MOSI: Controller_Sheet (U1.59), EtherCAT_Sheet (U19.17)
SPI2_NSS: Controller_Sheet (U1.60), EtherCAT_Sheet (U19.50)
SPI2_SCK: Controller_Sheet (U1.57), EtherCAT_Sheet (U19.19)
SWO/SCK_A: Sec_Controller_Sheet1 (J9.2 U11.39), Motor_Driver_Sheet1 (U15.31)
SWO/SCK_B: Sec_Controller_Sheet2 (J12.2 U12.39), Motor_Driver_Sheet2 (U16.31)
SWO/SCK_C: Motor_Driver_Sheet3 (U17.31), Sec_Controller_Sheet3 (J15.2 U13.39)
SWO/SCK_D: Motor_Driver_Sheet4 (U18.31), Sec_Controller_Sheet4 (J18.2 U14.39)
SYNC0: Controller_Sheet (U1.53), EtherCAT_Sheet (U19.34)
SYNC1: Controller_Sheet (U1.54), EtherCAT_Sheet (U19.18)
TCM0_1: Sec_Controller_Sheet1 (U29.23), DIO_1 (R233.1)
TCM0_2: Sec_Controller_Sheet2 (U35.23), DIO_2 (R263.1)
TCM0_3: Sec_Controller_Sheet3 (U49.23), DIO_3 (R288.1)
TCM0_4: Sec_Controller_Sheet4 (U51.23), DIO_4 (R313.1)
TCM1_1: Sec_Controller_Sheet1 (U29.24), DIO_1 (R235.1)
TCM1_2: Sec_Controller_Sheet2 (U35.24), DIO_2 (R265.1)
TCM1_3: Sec_Controller_Sheet3 (U49.24), DIO_3 (R290.1)
TCM1_4: Sec_Controller_Sheet4 (U51.24), DIO_4 (R315.1)
TXA_N: RJ45_Sheet (C140.2 J20.2 R146.1), EtherCAT_Sheet (U19.52)
TXA_P: RJ45_Sheet (C141.2 J20.1 R147.1), EtherCAT_Sheet (U19.53)
TXB_N: RJ45_Sheet (C146.2 J21.2 R154.1), EtherCAT_Sheet (U19.63)
TXB_P: RJ45_Sheet (C147.2 J21.1 R155.1), EtherCAT_Sheet (U19.62)
TXD-ENCD_1: Sec_Controller_Sheet1 (U11.22), Encoder_Sheet1 (R44.1 U9.7)
TXD-ENCD_2: Sec_Controller_Sheet2 (U12.22), Encoder_Sheet2 (R188.1 U10.7)
TXD-ENCD_3: Sec_Controller_Sheet3 (U13.22), Encoder_Sheet3 (R203.1 U21.7)
TXD-ENCD_4: Sec_Controller_Sheet4 (U14.22), Encoder_Sheet4 (R218.1 U22.7)
TXD/RS232: Controller_Sheet (U1.27), RS485_RS232_Sheet (U6.10)
USART2_RX: Controller_Sheet (U1.56), Sec_Controller_Sheet2 (U12.12)
USART2_TX: Controller_Sheet (U1.55), Sec_Controller_Sheet2 (U12.13)
USART3_RX: Controller_Sheet (U1.31), Sec_Controller_Sheet3 (U13.12)
USART3_TX: Controller_Sheet (U1.30), Sec_Controller_Sheet3 (U13.13)
USART4_RX: Controller_Sheet (U1.1), Sec_Controller_Sheet4 (U14.12)
USART4_TX: Controller_Sheet (U1.64), Sec_Controller_Sheet4 (U14.13)
USART6_RX: Controller_Sheet (U1.63), Sec_Controller_Sheet1 (U11.12)
USART6_TX: Controller_Sheet (U1.62), Sec_Controller_Sheet1 (U11.13)